# Altium schematic sheet Connectors.SchDoc
size A4
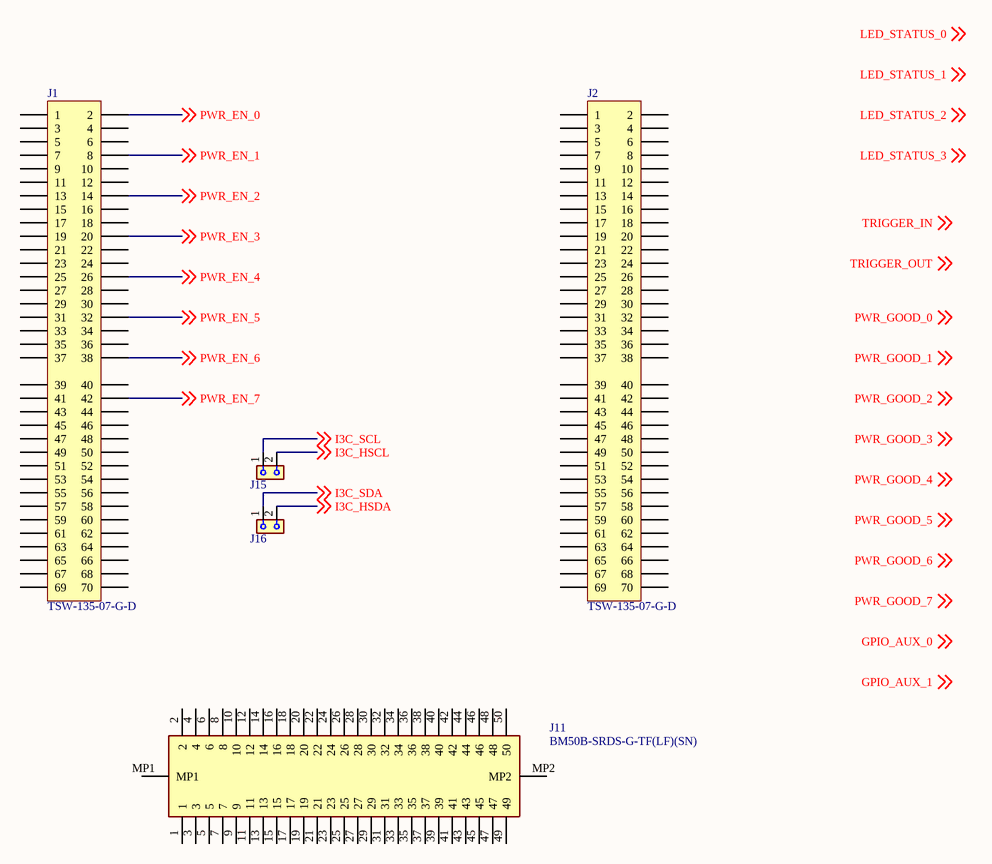
[diagram p0: Connectors.SchDoc]

## Parts
J1  TSW-135-07-G-D  [CON_SAMTEC_TSW-135-07-X-D]
J2  TSW-135-07-G-D  [CON_SAMTEC_TSW-135-07-X-D]
J11  BM50B-SRDS-G-TF(LF)(SN)  [BM50BSRDSGTFLFSN]
J15  TSW-102-07-F-S  (value not drawn)
J16  TSW-102-07-F-S  (value not drawn)

## Nets
I3C_HSCL: J15.2 ; off-sheet I3C_HSCL
I3C_HSDA: J16.2 ; off-sheet I3C_HSDA
I3C_SCL: J15.1 ; off-sheet I3C_SCL
I3C_SDA: J16.1 ; off-sheet I3C_SDA
PWR_EN_0: J1.2 ; off-sheet PWR_EN_0
PWR_EN_1: J1.8 ; off-sheet PWR_EN_1
PWR_EN_2: J1.14 ; off-sheet PWR_EN_2
PWR_EN_3: J1.20 ; off-sheet PWR_EN_3
PWR_EN_4: J1.26 ; off-sheet PWR_EN_4
PWR_EN_5: J1.32 ; off-sheet PWR_EN_5
PWR_EN_6: J1.38 ; off-sheet PWR_EN_6
PWR_EN_7: J1.42 ; off-sheet PWR_EN_7

Not connected (* = marked no-connect by the designer): J1 1 3 4 5 6 7 9 10 11 12 13 15 16 17 18 19 21 22 23 24 25 27 28 29 30 31 33 34 35 36 37 39 40 41 43 44 45 46 47 48 49 50 51 52 53 54 55 56 57 58 59 60 61 62 63 64 65 66 67 68 69 70; J2 1 2 3 4 5 6 7 8 9 10 11 12 13 14 15 16 17 18 19 20 21 22 23 24 25 26 27 28 29 30 31 32 33 34 35 36 37 38 39 40 41 42 43 44 45 46 47 48 49 50 51 52 53 54 55 56 57 58 59 60 61 62 63 64 65 66 67 68 69 70; J11 1 2 3 4 5 6 7 8 9 10 11 12 13 14 15 16 17 18 19 20 21 22 23 24 25 26 27 28 29 30 31 32 33 34 35 36 37 38 39 40 41 42 43 44 45 46 47 48 49 50 MP1 MP2

## Notes on the sheet
- Labels drawn without touching a wire or pin: GPIO_AUX_0, GPIO_AUX_1, LED_STATUS_0, LED_STATUS_1, LED_STATUS_2, LED_STATUS_3, PWR_GOOD_0, PWR_GOOD_1, PWR_GOOD_2, PWR_GOOD_3, PWR_GOOD_4, PWR_GOOD_5, PWR_GOOD_6, PWR_GOOD_7, TRIGGER_IN, TRIGGER_OUT

## Library data of the parts
J1 J2 = TSW-135-07-G-D: Header, 35x2, 2,54mm, VR, TH, Height 5.84mm/2.54mm; Manufacturer: Samtec; DrownBy: Xavier Rocher; Package: 0603; Supplier 1: Farnell; Supplier  Part Number 1: 3664498; Supplier 2: Mouser; Supplier  Part Number 2: 200-TSW13507GD; Manufacturer Part Number: TSW-135-07-G-D; Value: TSW-135-07-G-D
J11 = BM50B-SRDS-G-TF(LF)(SN): Manufacturer: JST; DrownBy: Xavier Rocher; Datasheet: https://www.farnell.com/datasheets/2085439.pdf?_gl=1*149c80b*_gcl_aw*R0NMLjE3NzI0MzkxNjIuQ2p3S0NBaUFoNVhOQmhBQUVpd0FfQnU4RlZpZGN3SFZkTmhUaGpab0lwT1FoQkFLZGxhWW9IVVdZQjN2WlhqdGU5dFd2US1sQTZFMy14b0NDLUVRQXZEX0J3RQ..*_gcl_au*MjEwMjY0Mzg0MC4xNzcyNDM5MTYx; Package: BM50B Series; Supplier 1: Farnell; Supplier  Part Number 1: 2399332; Supplier 2: Mouser; Supplier  Part Number 2: 306-BM50BSRDSGTFLFSN; Manufacturer Part Number: BM50B-SRDS-G-TF(LF)(SN); Value: BM50B-SRDS-G-TF(LF)(SN)
J15 J16 = TSW-102-07-F-S: Alojamientos de cables y cabecera 2.54MM CLASSIC PCB HDR STRIP; Manufacturer: SAMTEC; DrownBy: Xavier Rocher; Datasheet: https://www.farnell.com/datasheets/1701645.pdf?_gl=1*1o3ly18*_gcl_aw*R0NMLjE3NzI0NTg0MDAuQ2p3S0NBaUFoNVhOQmhBQUVpd0FfQnU4RlFpaGh0aTJCR0F1SXBlQ2pXMWtFYmlZc2JraDRpajgydjZyT2lxVUUtZHBLLW80X0NoNy1Sb0NSZjhRQXZEX0J3RQ..*_gcl_au*MjEwMjY0Mzg0MC4xNzcyNDM5MTYx; Package: 0603; Supplier 1: Farnell; Supplier  Part Number 1: 2779661; Supplier 2: Mouser; Supplier  Part Number 2: 200-TSW10207FS; Manufacturer Part Number: TSW-102-07-F-S; Value: TSW-102-07-F-S